# Altium schematic sheet 2_Encoder_Interface.SchDoc
size B
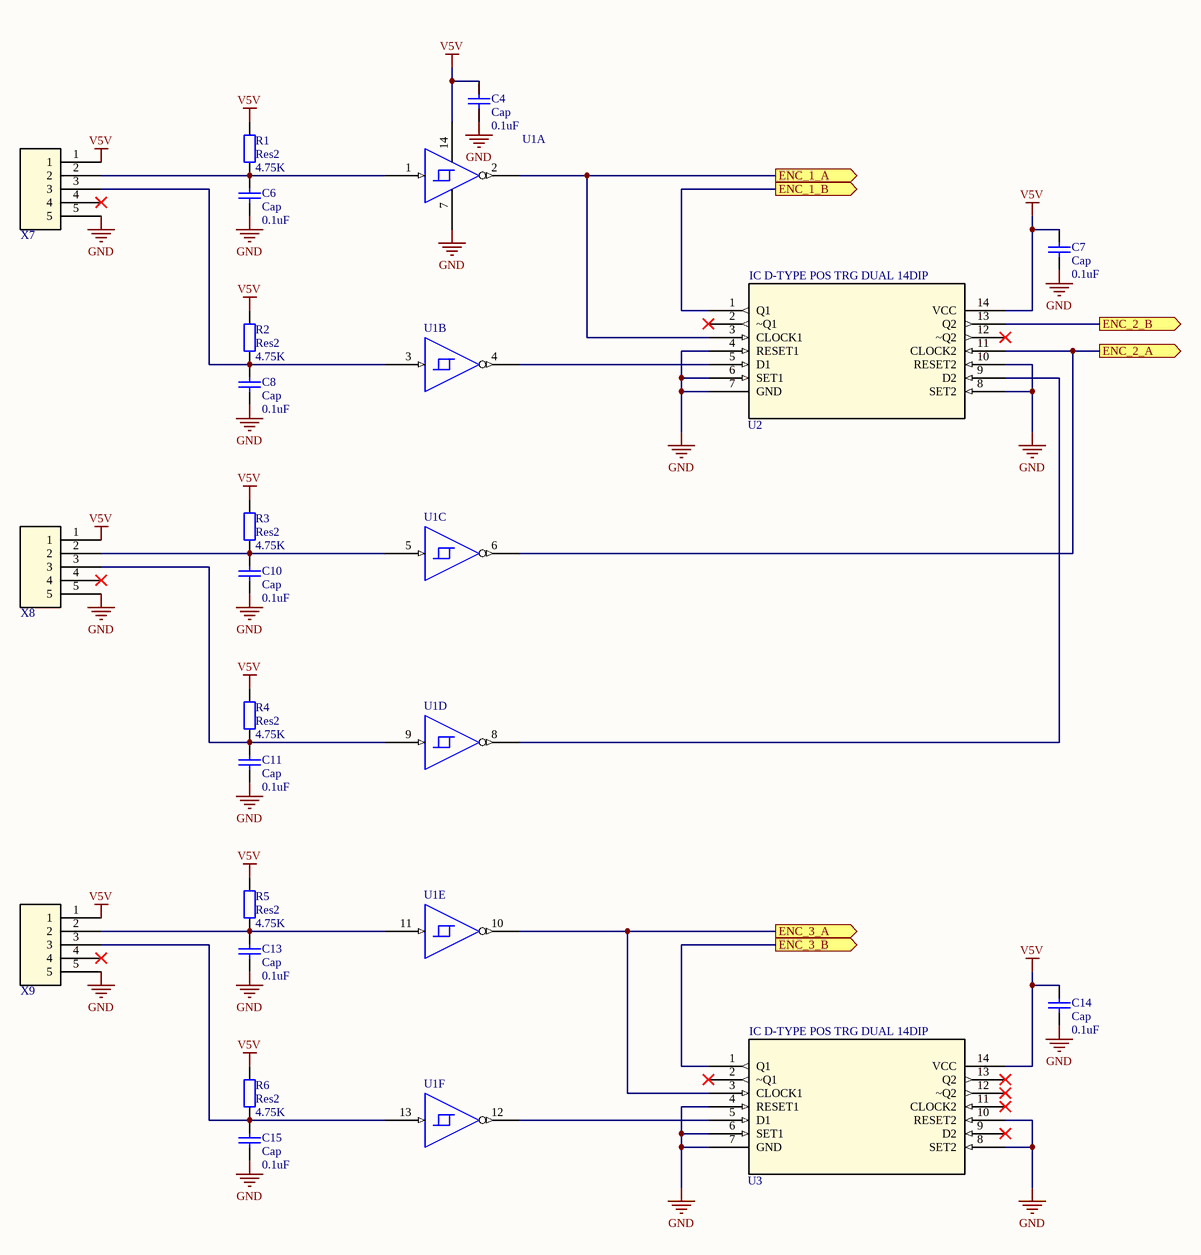
[diagram p0: 2_Encoder_Interface.SchDoc]

## Parts
C4  Cap  value 0.1uF  [RAD-0.3]
C6  Cap  value 0.1uF  [RAD-0.3]
C7  Cap  value 0.1uF  [RAD-0.3]
C8  Cap  value 0.1uF  [RAD-0.3]
C10  Cap  value 0.1uF  [RAD-0.3]
C11  Cap  value 0.1uF  [RAD-0.3]
C13  Cap  value 0.1uF  [RAD-0.3]
C14  Cap  value 0.1uF  [RAD-0.3]
C15  Cap  value 0.1uF  [RAD-0.3]
R1  Res2  value 4.75K  [AXIAL-0.4]
R2  Res2  value 4.75K  [AXIAL-0.4]
R3  Res2  value 4.75K  [AXIAL-0.4]
R4  Res2  value 4.75K  [AXIAL-0.4]
R5  Res2  value 4.75K  [AXIAL-0.4]
R6  Res2  value 4.75K  [AXIAL-0.4]
U1  IC HEX SCHMITT-TRIG INV 14-DIP  [14-DIP]  (value not drawn)  (parts A,B,C,D,E,F of 6)
U2  IC D-TYPE POS TRG DUAL 14DIP  [14-DIP]
U3  IC D-TYPE POS TRG DUAL 14DIP  [14-DIP]
X7  TERM BLOCK HDR 5POS VERT 3.5MM  [WR-TBL-3211 5]  (value not drawn)
X8  TERM BLOCK HDR 5POS VERT 3.5MM  [WR-TBL-3211 5]  (value not drawn)
X9  TERM BLOCK HDR 5POS VERT 3.5MM  [WR-TBL-3211 5]  (value not drawn)

## Ports
ENC_1_A (out), ENC_1_B (out), ENC_2_A (out), ENC_2_B (out), ENC_3_A (out), ENC_3_B (out)

## Nets
GND: C4.1 C6.1 C7.1 C8.1 C10.1 C11.1 C13.1 C14.1 C15.1 U1.7(GND_POWER) U2.4(RESET1) U2.6(SET1) U2.7(GND) U2.8(SET2) U2.10(RESET2) U3.4(RESET1) U3.6(SET1) U3.7(GND) U3.8(SET2) U3.10(RESET2) X7.5 X8.5 X9.5
V5V: C4.2 C7.2 C14.2 R1.2 R2.2 R3.2 R4.2 R5.2 R6.2 U1.14(VCC) U2.14(VCC) U3.14(VCC) X7.1 X8.1 X9.1
ENC_1_A: U1.2(Y) U2.3(CLOCK1) ; port ENC_1_A
ENC_1_B: U2.1(Q1) ; port ENC_1_B
ENC_2_A: U1.6(Y) U2.11(CLOCK2) ; port ENC_2_A
ENC_2_B: U2.13(Q2) ; port ENC_2_B
ENC_3_A: U1.10(Y) U3.3(CLOCK1) ; port ENC_3_A
ENC_3_B: U3.1(Q1) ; port ENC_3_B
NetC6_2: C6.2 R1.1 U1.1(A) X7.2
NetC8_2: C8.2 R2.1 U1.3(A) X7.3
NetC10_2: C10.2 R3.1 U1.5(A) X8.2
NetC11_2: C11.2 R4.1 U1.9(A) X8.3
NetC13_2: C13.2 R5.1 U1.11(A) X9.2
NetC15_2: C15.2 R6.1 U1.13(A) X9.3
NetU1_4: U1.4(Y) U2.5(D1)
NetU1_8: U1.8(Y) U2.9(D2)
NetU1_12: U1.12(Y) U3.5(D1)

Not connected (* = marked no-connect by the designer): U2 2(~Q1)* 12(~Q2)*; U3 2(~Q1)* 9(D2)* 11(CLOCK2)* 12(~Q2)* 13(Q2)*; X7 4*; X8 4*; X9 4*

## Notes on the sheet
- ESE
- is the sole property of ESE. Any reproduction
- The Information Contained in this drawing
- Schematic P/N and Name
- Sheet Name
- 299 Doon Valley Drive
- Kitchener, ON N2G 4M4
- Canada
- Approved
- in part or in whole without the written
- permission of ESE is strictly prohibited.
- APPROVALS
- DATE
- Size
- Scale
- B
- NTS
- Bare PCB P/N
- Date
- Sheet
- Rev.
- Checked
- Engineer
- of

## Library data of the parts
C4 C6-C8 C10 C11 C13-C15 = Cap: Capacitor; Published: 8-Jun-2000; LatestRevisionDate: 17-Jul-2002; LatestRevisionNote: Re-released for DXP Platform.; PackageReference: RAD-0.3; Publisher: Altium Limited; PackageDescription: Radial Cap, Thru-Hole; 2 Leads; 0.3 in Pin Spacing
R1-R6 = Res2: Resistor; Published: 8-Jun-2000; LatestRevisionDate: 17-Jul-2002; LatestRevisionNote: Re-released for DXP Platform.; PackageReference: AXIAL-0.4; Publisher: Altium Limited; PackageDescription: Axial Device, Thru-Hole; 2 Leads; 0.4 in Pin Spacing
U1 = IC HEX SCHMITT-TRIG INV 14-DIP: Manufactuer_Part_Number: SN74ACT14N; Manufacturer: Texas Instruments; Digi-Key_Part_Number: 296-4368-5-ND
U2 U3 = IC D-TYPE POS TRG DUAL 14DIP: Manufacturer_Part_Number: CD4013BE; Manufacturer: Texas Instruments; Digi-Key_Part_Number: 296-2033-5-ND
X7-X9 = TERM BLOCK HDR 5POS VERT 3.5MM: Manufacturer_Part_Number: 691321100005; Manufacturer: Wurth Electronics Inc; DigiKey_Part_Number: 732-2766-ND